# Altium schematic sheet vemt.SchDoc
size A2
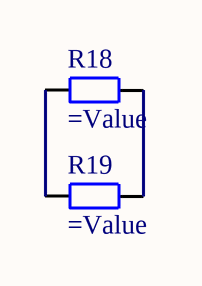
[diagram p0: vemt.SchDoc]

## Parts
R18  (no value)  [res0805]
R19  (no value)  [smd2010]

## Nets
NetR18_1: R18.1 R19.1
NetR18_2: R18.2 R19.2

## Library data of the parts
R18 R19 = Resistor SMD